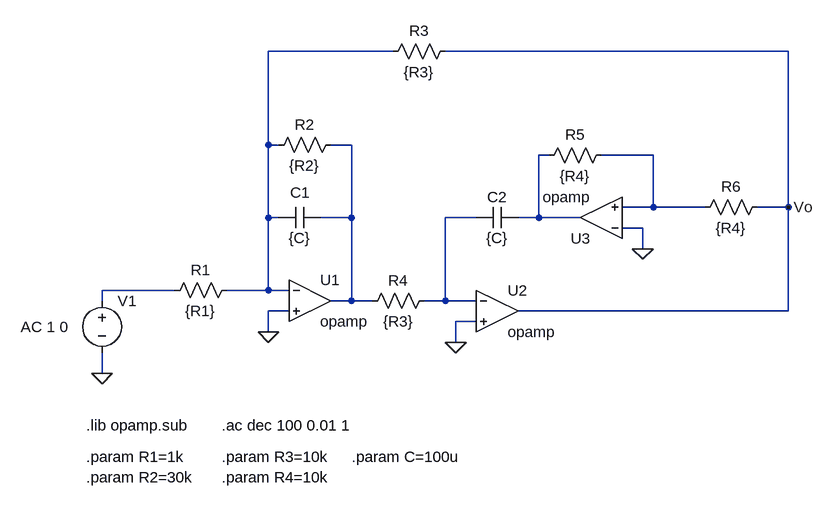
[diagram p0: schematic TS2_TC2.asc]
TS2_TC2.asc, the LTspice schematic file:
Version 4
SHEET 1 880 680
WIRE 160 -144 -32 -144
WIRE 768 -144 240 -144
WIRE -32 0 -32 -144
WIRE -16 0 -32 0
WIRE 96 0 64 0
WIRE 400 16 384 16
WIRE 560 16 480 16
WIRE 560 96 560 16
WIRE 560 96 512 96
WIRE 640 96 560 96
WIRE 768 96 768 -144
WIRE 768 96 720 96
WIRE -32 112 -32 0
WIRE -16 112 -32 112
WIRE 96 112 96 0
WIRE 96 112 48 112
WIRE 288 112 240 112
WIRE 384 112 384 16
WIRE 384 112 352 112
WIRE 448 112 384 112
WIRE 544 128 512 128
WIRE 544 160 544 128
WIRE -176 224 -288 224
WIRE -32 224 -32 112
WIRE -32 224 -96 224
WIRE 0 224 -32 224
WIRE -288 240 -288 224
WIRE 96 240 96 112
WIRE 96 240 64 240
WIRE 128 240 96 240
WIRE 240 240 240 112
WIRE 240 240 208 240
WIRE 288 240 240 240
WIRE 0 256 -32 256
WIRE 768 256 768 96
WIRE 768 256 352 256
WIRE 288 272 256 272
WIRE -32 288 -32 256
WIRE 256 304 256 272
WIRE -288 352 -288 320
FLAG 544 160 0
FLAG 256 304 0
FLAG -32 288 0
FLAG -288 352 0
FLAG 768 96 Vo
SYMBOL Opamps\\opamp 32 176 R0
SYMATTR InstName U1
SYMBOL Opamps\\opamp 320 192 R0
SYMATTR InstName U2
SYMBOL Opamps\\opamp 480 176 R180
SYMATTR InstName U3
SYMBOL res 496 0 R90
WINDOW 0 0 56 VBottom 2
WINDOW 3 32 56 VTop 2
SYMATTR InstName R5
SYMATTR Value {R4}
SYMBOL res 736 80 R90
WINDOW 0 0 56 VBottom 2
WINDOW 3 32 56 VTop 2
SYMATTR InstName R6
SYMATTR Value {R4}
SYMBOL res 224 224 R90
WINDOW 0 0 56 VBottom 2
WINDOW 3 32 56 VTop 2
SYMATTR InstName R4
SYMATTR Value {R3}
SYMBOL res 80 -16 R90
WINDOW 0 0 56 VBottom 2
WINDOW 3 32 56 VTop 2
SYMATTR InstName R2
SYMATTR Value {R2}
SYMBOL res 256 -160 R90
WINDOW 0 0 56 VBottom 2
WINDOW 3 32 56 VTop 2
SYMATTR InstName R3
SYMATTR Value {R3}
SYMBOL res -80 208 R90
WINDOW 0 0 56 VBottom 2
WINDOW 3 32 56 VTop 2
SYMATTR InstName R1
SYMATTR Value {R1}
SYMBOL cap 352 96 R90
WINDOW 0 0 32 VBottom 2
WINDOW 3 32 32 VTop 2
SYMATTR InstName C2
SYMATTR Value {C}
SYMBOL cap 48 96 R90
WINDOW 0 -7 31 VBottom 2
WINDOW 3 32 32 VTop 2
SYMATTR InstName C1
SYMATTR Value {C}
SYMBOL voltage -288 224 R0
WINDOW 123 -125 56 Left 2
WINDOW 39 0 0 Left 2
SYMATTR Value2 AC 1 0
SYMATTR InstName V1
SYMATTR Value ""
TEXT -104 432 Left 2 !.ac dec 100 0.01 1
TEXT -312 432 Left 2 !.lib opamp.sub
TEXT -312 480 Left 2 !.param R1=1k
TEXT -312 512 Left 2 !.param R2=30k
TEXT -104 480 Left 2 !.param R3=10k
TEXT -104 512 Left 2 !.param R4=10k
TEXT 96 480 Left 2 !.param C=100u

The netlist it stands for:
* TS2_TC2.asc
XU1 N001 0 N002 opamp Aol=100K GBW=10Meg  ; pins invin noninvin out
XU2 N005 0 Vo opamp Aol=100K GBW=10Meg  ; pins invin noninvin out
XU3 0 N004 N003 opamp Aol=100K GBW=10Meg  ; pins invin noninvin out
R5 N004 N003 {R4}
R6 Vo N004 {R4}
R4 N005 N002 {R3}
R2 N002 N001 {R2}
R3 Vo N001 {R3}
R1 N001 N006 {R1}
C2 N003 N005 {C}
C1 N002 N001 {C}
V1 N006 0 AC 1 0
.ac dec 100 0.01 1
.lib opamp.sub
.param R1=1k
.param R2=30k
.param R3=10k
.param R4=10k
.param C=100u
.backanno
.end